# Altium schematic sheet Mako DSP Main R1.2.SchDoc
size B
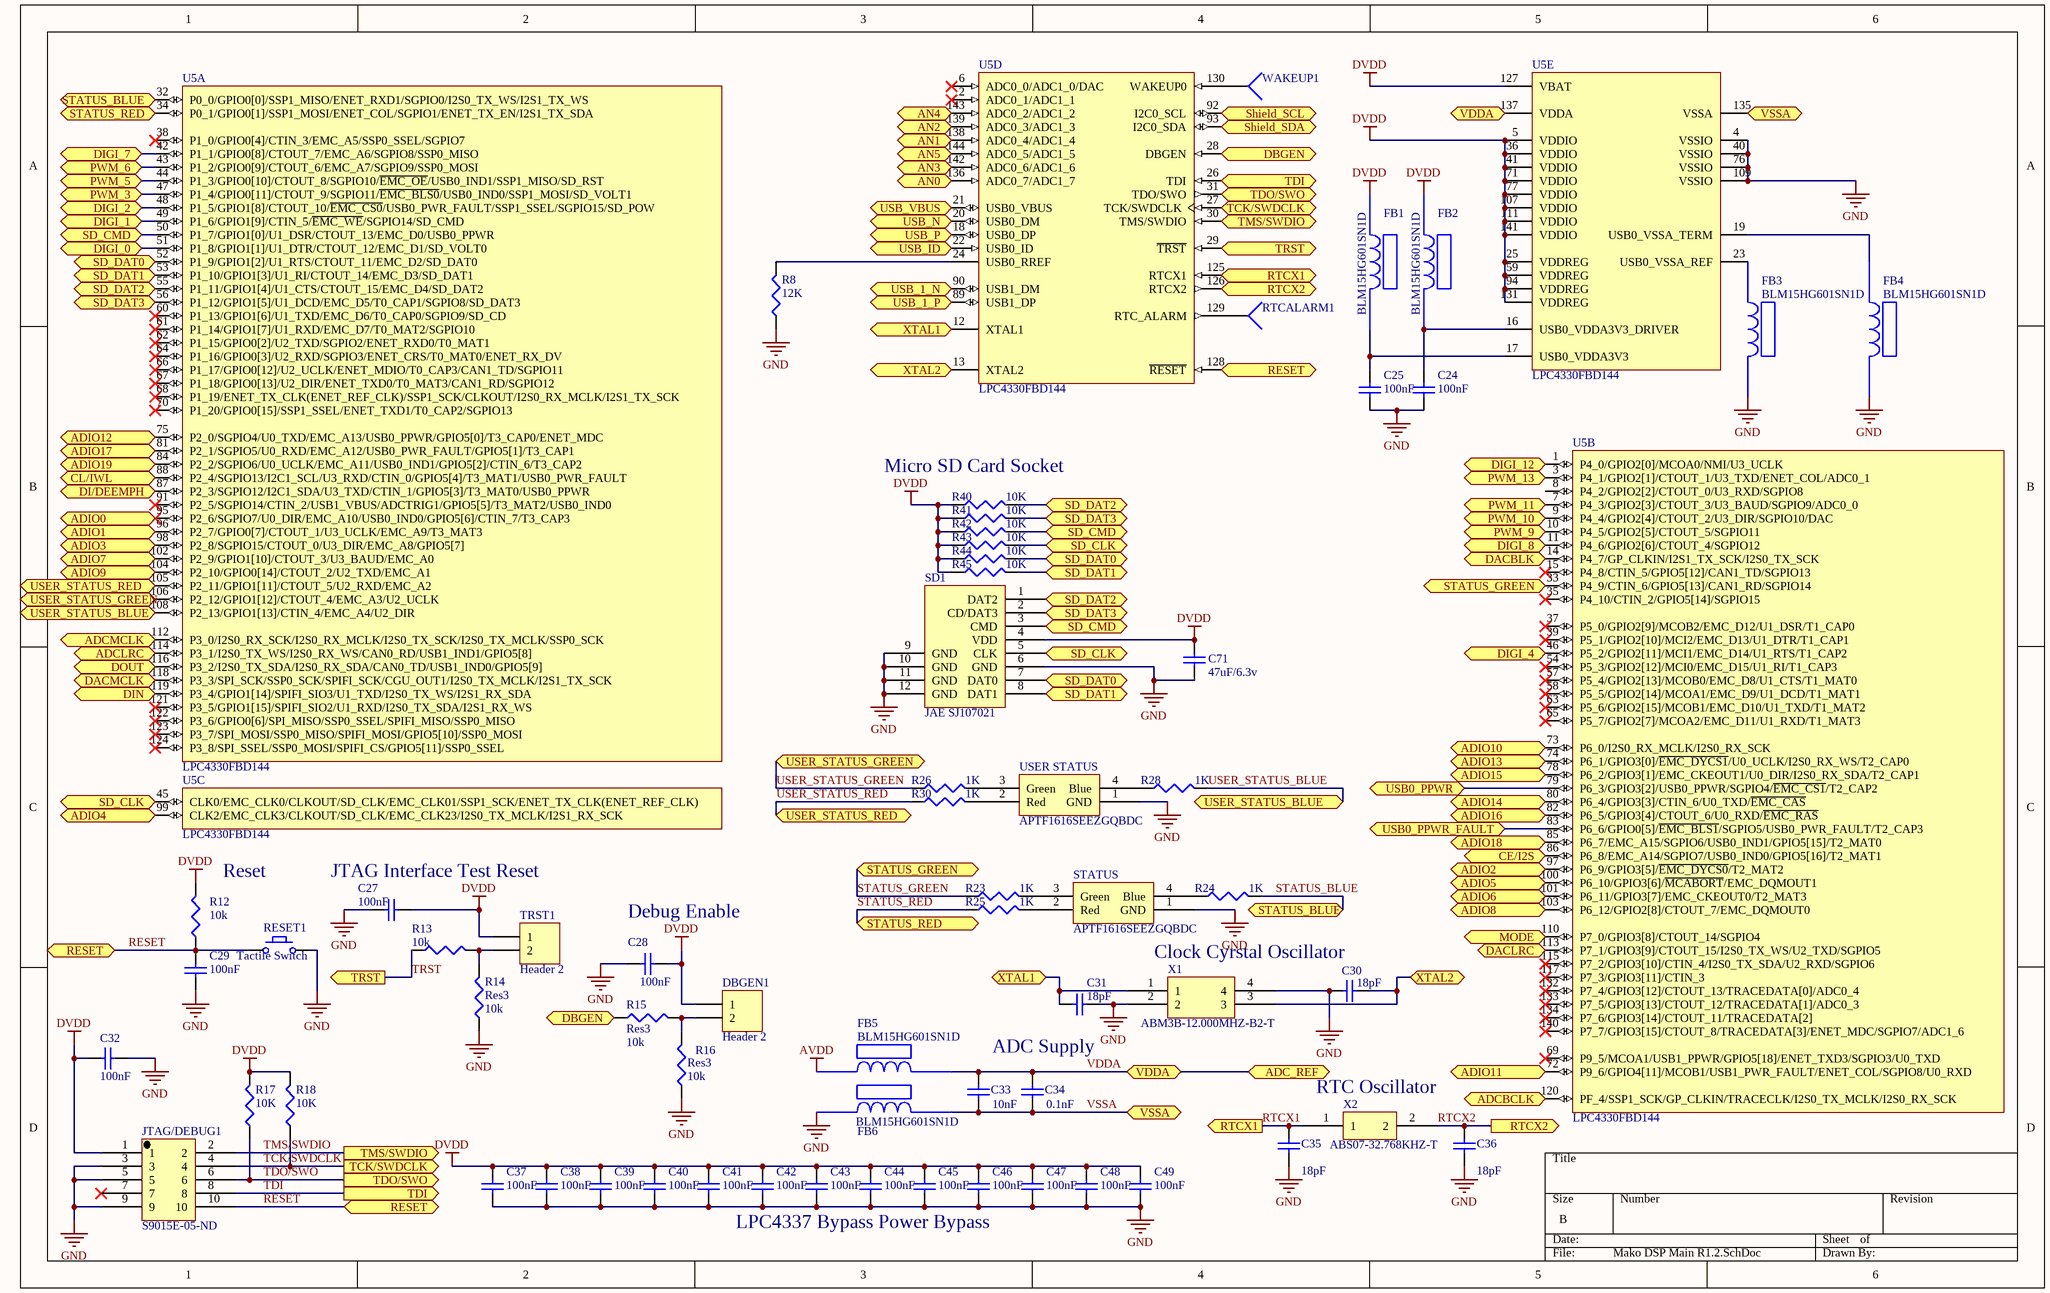
[diagram p0: Mako DSP Main R1.2.SchDoc]

## Parts
C24  value 100nF  [0402]  (hidden comment: Cap Semi)
C25  value 100nF  [0402]  (hidden comment: Cap Semi)
C27  C1: 100nF  [CAPC1608L]  (hidden comment: Cap Semi)
C28  C1: 100nF  [CAPC1608L]  (hidden comment: Cap Semi)
C29  C1: 100nF  [CAPC1608L]  (hidden comment: Cap Semi)
C30  value 18pF  [1608[0603]]  (hidden comment: Cap Semi)
C31  value 18pF  [1608[0603]]  (hidden comment: Cap Semi)
C32  C1: 100nF  [CAPC1608L]  (hidden comment: Cap Semi)
C33  value 10nF  [1608[0603]]  (hidden comment: Cap Semi)
C34  value 0.1nF  [1608[0603]]  (hidden comment: Cap Semi)
C35  value 18pF  [1608[0603]]  (hidden comment: Cap Semi)
C36  value 18pF  [1608[0603]]  (hidden comment: Cap Semi)
C37  value 100nF  [1608[0603]]  (hidden comment: Cap Semi)
C38  value 100nF  [1608[0603]]  (hidden comment: Cap Semi)
C39  value 100nF  [1608[0603]]  (hidden comment: Cap Semi)
C40  value 100nF  [1608[0603]]  (hidden comment: Cap Semi)
C41  value 100nF  [1608[0603]]  (hidden comment: Cap Semi)
C42  value 100nF  [1608[0603]]  (hidden comment: Cap Semi)
C43  value 100nF  [1608[0603]]  (hidden comment: Cap Semi)
C44  value 100nF  [1608[0603]]  (hidden comment: Cap Semi)
C45  value 100nF  [1608[0603]]  (hidden comment: Cap Semi)
C46  value 100nF  [1608[0603]]  (hidden comment: Cap Semi)
C47  value 100nF  [1608[0603]]  (hidden comment: Cap Semi)
C48  value 100nF  [1608[0603]]  (hidden comment: Cap Semi)
C49  value 100nF  [1608[0603]]  (hidden comment: Cap Semi)
C71  value 47uF/6.3v  [Panasonic VS B]  (hidden comment: Cap Semi)
DBGEN1  Header 2  [HDR1X2]
FB1  BLM15HG601SN1D  [BLM18PG121SN1D]
FB2  BLM15HG601SN1D  [BLM18PG121SN1D]
FB3  BLM15HG601SN1D  [BLM18PG121SN1D]
FB4  BLM15HG601SN1D  [BLM18PG121SN1D]
FB5  BLM15HG601SN1D  [BLM18PG121SN1D]
FB6  BLM15HG601SN1D  [BLM18PG121SN1D]
JTAG/DEBUG1  S9015E-05-ND  [S9015E-05-ND]
R8  value 12K  [J1-0603]  (hidden comment: Res3)
R12  value 10k  [J1-0603]  (hidden comment: Res3)
R13  value 10k  [J1-0603]  (hidden comment: Res3)
R14  Res3  value 10k  [J1-0603]
R15  Res3  value 10k  [J1-0603]
R16  Res3  value 10k  [J1-0603]
R17  value 10K  [J1-0603]  (hidden comment: Res3)
R18  value 10K  [J1-0603]  (hidden comment: Res3)
R23  value 1K  [J1-0603]  (hidden comment: Res3)
R24  value 1K  [J1-0603]  (hidden comment: Res3)
R25  value 1K  [J1-0603]  (hidden comment: Res3)
R26  value 1K  [J1-0603]  (hidden comment: Res3)
R28  value 1K  [J1-0603]  (hidden comment: Res3)
R30  value 1K  [J1-0603]  (hidden comment: Res3)
R40  value 10K  [J1-0603]  (hidden comment: Res3)
R41  value 10K  [J1-0603]  (hidden comment: Res3)
R42  value 10K  [J1-0603]  (hidden comment: Res3)
R43  value 10K  [J1-0603]  (hidden comment: Res3)
R44  value 10K  [J1-0603]  (hidden comment: Res3)
R45  value 10K  [J1-0603]  (hidden comment: Res3)
RESET1  Tactile Switch  [TL3301]
RTCALARM1  Socket  [PIN1]  (value not drawn)
SD1  JAE SJ107021  [JAE SJ107021]
STATUS  APTF1616SEEZGQBDC  [RGB LED APTF1616SEEZGQBDC]
TRST1  Header 2  [HDR1X2]
U5  LPC4330FBD144  [SOT486-1_V]  (parts A,B,C,D,E of 5)
USER_STATUS  APTF1616SEEZGQBDC  [RGB LED APTF1616SEEZGQBDC]
WAKEUP1  Socket  [PIN1]  (value not drawn)
X1  ABM3B-12.000MHZ-B2-T  [ABM3B-12.000MHZ-B2-T]
X2  ABS07-32.768KHZ-T  [ABS07-32.768KHZ-T]

## Ports
ADC_REF, ADCBCLK (bidir), ADCLRC (bidir), ADCMCLK (bidir), ADIO0 (bidir), ADIO1 (bidir), ADIO2 (bidir), ADIO3 (bidir), ADIO4, ADIO5 (bidir), ADIO6 (bidir), ADIO7, ADIO8 (bidir), ADIO9, ADIO10 (bidir), ADIO11 (bidir), ADIO12 (bidir), ADIO13 (bidir), ADIO14 (bidir), ADIO15 (bidir), ADIO16 (bidir), ADIO17 (bidir), ADIO18 (bidir), ADIO19 (bidir), AN0 (bidir), AN1 (bidir), AN2 (bidir), AN3 (bidir), AN4 (bidir), AN5 (bidir), CE/I2S (bidir), CL/IWL (bidir), DACBLK (bidir), DACLRC (bidir), DACMCLK (bidir), DBGEN (in), DBGEN (out), DI/DEEMPH (bidir), DIGI_0 (bidir), DIGI_1 (bidir), DIGI_2 (bidir), DIGI_4 (bidir), DIGI_7 (bidir), DIGI_8 (bidir), DIGI_12 (bidir), DIN (bidir), DOUT (bidir), MODE (bidir), PWM_3 (bidir), PWM_5 (bidir), PWM_6 (bidir), PWM_9 (bidir), PWM_10 (bidir), PWM_11 (bidir), PWM_13 (bidir), RESET (bidir), RTCX1 (in), RTCX1 (out), RTCX2 (out), SD_CLK (bidir), SD_CMD (bidir), SD_DAT0 (bidir), SD_DAT1 (bidir), SD_DAT2 (bidir), SD_DAT3 (bidir), Shield_SCL (bidir), Shield_SDA (bidir), STATUS_BLUE (bidir), STATUS_GREEN (bidir), STATUS_RED (bidir), TCK/SWDCLK (in), TCK/SWDCLK (out), TDI (in), TDI (out), TDO/SWO (out), TMS/SWDIO (in), TMS/SWDIO (out), TRST (in), TRST (out), USB0_PPWR (bidir), USB0_PPWR_FAULT (bidir), USB_1_N (bidir), USB_1_P (bidir), USB_ID (bidir), USB_N (bidir), USB_P (bidir), USB_VBUS (bidir), USER_STATUS_BLUE (bidir), USER_STATUS_GREEN (bidir), USER_STATUS_RED (bidir), VDDA, VSSA, XTAL1 (bidir), XTAL2 (bidir)

## Nets
AVDD: FB5.1
DVDD: C27.2 C28.2 C32.1 C37.2 C38.2 C39.2 C40.2 C41.2 C42.2 C43.2 C44.2 C45.2 C46.2 C47.2 C48.2 C49.2 C71.2 DBGEN1.1 FB1.1 FB2.1 JTAG/DEBUG1.1 R12.2 R17.2 R18.2 R40.1 R41.1 R42.1 R43.1 R44.1 R45.1 SD1.4(VDD) TRST1.1 U5.5(VDDIO) U5.25(VDDREG) U5.36(VDDIO) U5.41(VDDIO) U5.59(VDDREG) U5.71(VDDIO) U5.77(VDDIO) U5.94(VDDREG) U5.107(VDDIO) U5.111(VDDIO) U5.127(VBAT) U5.131(VDDREG) U5.141(VDDIO)
GND: C24.1 C25.1 C27.1 C28.1 C29.1 C30.2 C31.1 C32.2 C35.1 C36.1 C37.1 C38.1 C39.1 C40.1 C41.1 C42.1 C43.1 C44.1 C45.1 C46.1 C47.1 C48.1 C49.1 C71.1 FB3.2 FB4.2 FB6.1 JTAG/DEBUG1.3 JTAG/DEBUG1.5 JTAG/DEBUG1.9 R8.1 R14.1 R16.1 RESET1.2 SD1.6(GND) SD1.9(GND) SD1.10(GND) SD1.11(GND) SD1.12(GND) STATUS.1(GND) U5.4(VSSIO) U5.40(VSSIO) U5.76(VSSIO) U5.109(VSSIO) USER_STATUS.1(GND) X1.2 X1.4
ADCBCLK: U5.120(PF_4/SSP1_SCK/GP_CLKIN/TRACECLK/I2S0_TX_MCLK/I2S0_RX_SCK) ; port ADCBCLK
ADCLRC: U5.114(P3_1/I2S0_TX_WS/I2S0_RX_WS/CAN0_RD/USB1_IND1/GPIO5[8]) ; port ADCLRC
ADCMCLK: U5.112(P3_0/I2S0_RX_SCK/I2S0_RX_MCLK/I2S0_TX_SCK/I2S0_TX_MCLK/SSP0_SCK) ; port ADCMCLK
ADIO0: U5.95(P2_6/SGPIO7/U0_DIR/EMC_A10/USB0_IND0/GPIO5[6]/CTIN_7/T3_CAP3) ; port ADIO0
ADIO1: U5.96(P2_7/GPIO0[7]/CTOUT_1/U3_UCLK/EMC_A9/T3_MAT3) ; port ADIO1
ADIO2: U5.97(P6_9/GPIO3[5]/~{EMC_DYCS0}/T2_MAT2) ; port ADIO2
ADIO3: U5.98(P2_8/SGPIO15/CTOUT_0/U3_DIR/EMC_A8/GPIO5[7]) ; port ADIO3
ADIO4: U5.99(CLK2/EMC_CLK3/CLKOUT/SD_CLK/EMC_CLK23/I2S0_TX_MCLK/I2S1_RX_SCK) ; port ADIO4
ADIO5: U5.100(P6_10/GPIO3[6]/~{MCABORT}/EMC_DQMOUT1) ; port ADIO5
ADIO6: U5.101(P6_11/GPIO3[7]/EMC_CKEOUT0/T2_MAT3) ; port ADIO6
ADIO7: U5.102(P2_9/GPIO1[10]/CTOUT_3/U3_BAUD/EMC_A0) ; port ADIO7
ADIO8: U5.103(P6_12/GPIO2[8]/CTOUT_7/EMC_DQMOUT0) ; port ADIO8
ADIO9: U5.104(P2_10/GPIO0[14]/CTOUT_2/U2_TXD/EMC_A1) ; port ADIO9
ADIO10: U5.73(P6_0/I2S0_RX_MCLK/I2S0_RX_SCK) ; port ADIO10
ADIO11: U5.72(P9_6/GPIO4[11]/MCOB1/USB1_PWR_FAULT/ENET_COL/SGPIO8/U0_RXD) ; port ADIO11
ADIO12: U5.75(P2_0/SGPIO4/U0_TXD/EMC_A13/USB0_PPWR/GPIO5[0]/T3_CAP0/ENET_MDC) ; port ADIO12
ADIO13: U5.74(P6_1/GPIO3[0]/~{EMC_DYCS1}/U0_UCLK/I2S0_RX_WS/T2_CAP0) ; port ADIO13
ADIO14: U5.80(P6_4/GPIO3[3]/CTIN_6/U0_TXD/~{EMC_CAS}) ; port ADIO14
ADIO15: U5.78(P6_2/GPIO3[1]/EMC_CKEOUT1/U0_DIR/I2S0_RX_SDA/T2_CAP1) ; port ADIO15
ADIO16: U5.82(P6_5/GPIO3[4]/CTOUT_6/U0_RXD/~{EMC_RAS}) ; port ADIO16
ADIO17: U5.81(P2_1/SGPIO5/U0_RXD/EMC_A12/USB0_PWR_FAULT/GPIO5[1]/T3_CAP1) ; port ADIO17
ADIO18: U5.85(P6_7/EMC_A15/SGPIO6/USB0_IND1/GPIO5[15]/T2_MAT0) ; port ADIO18
ADIO19: U5.84(P2_2/SGPIO6/U0_UCLK/EMC_A11/USB0_IND1/GPIO5[2]/CTIN_6/T3_CAP2) ; port ADIO19
AN0: U5.136(ADC0_7/ADC1_7) ; port AN0
AN1: U5.138(ADC0_4/ADC1_4) ; port AN1
AN2: U5.139(ADC0_3/ADC1_3) ; port AN2
AN3: U5.142(ADC0_6/ADC1_6) ; port AN3
AN4: U5.143(ADC0_2/ADC1_2) ; port AN4
AN5: U5.144(ADC0_5/ADC1_5) ; port AN5
CE/I2S: U5.86(P6_8/EMC_A14/SGPIO7/USB0_IND0/GPIO5[16]/T2_MAT1) ; port CE/I2S
CL/IWL: U5.88(P2_4/SGPIO13/I2C1_SCL/U3_RXD/CTIN_0/GPIO5[4]/T3_MAT1/USB0_PWR_FAULT) ; port CL/IWL
DACBLK: U5.14(P4_7/GP_CLKIN/I2S1_TX_SCK/I2S0_TX_SCK) ; port DACBLK
DACLRC: U5.113(P7_1/GPIO3[9]/CTOUT_15/I2S0_TX_WS/U2_TXD/SGPIO5) ; port DACLRC
DACMCLK: U5.118(P3_3/SPI_SCK/SSP0_SCK/SPIFI_SCK/CGU_OUT1/I2S0_TX_MCLK/I2S1_TX_SCK) ; port DACMCLK
DBGEN: R15.1 U5.28(DBGEN) ; port DBGEN
DI/DEEMPH: U5.87(P2_3/SGPIO12/I2C1_SDA/U3_TXD/CTIN_1/GPIO5[3]/T3_MAT0/USB0_PPWR) ; port DI/DEEMPH
DIGI_0: U5.51(P1_8/GPIO1[1]/U1_DTR/CTOUT_12/EMC_D1/SD_VOLT0) ; port DIGI_0
DIGI_1: U5.49(P1_6/GPIO1[9]/CTIN_5/~{EMC_WE}/SGPIO14/SD_CMD) ; port DIGI_1
DIGI_2: U5.48(P1_5/GPIO1[8]/CTOUT_10/~{EMC_CS0}/USB0_PWR_FAULT/SSP1_SSEL/SGPIO15/SD_POW) ; port DIGI_2
DIGI_4: U5.46(P5_2/GPIO2[11]/MCI1/EMC_D14/U1_RTS/T1_CAP2) ; port DIGI_4
DIGI_7: U5.42(P1_1/GPIO0[8]/CTOUT_7/EMC_A6/SGPIO8/SSP0_MISO) ; port DIGI_7
DIGI_8: U5.11(P4_6/GPIO2[6]/CTOUT_4/SGPIO12) ; port DIGI_8
DIGI_12: U5.1(P4_0/GPIO2[0]/MCOA0/NMI/U3_UCLK) ; port DIGI_12
DIN: U5.119(P3_4/GPIO1[14]/SPIFI_SIO3/U1_TXD/I2S0_TX_WS/I2S1_RX_SDA) ; port DIN
DOUT: U5.116(P3_2/I2S0_TX_SDA/I2S0_RX_SDA/CAN0_TD/USB1_IND0/GPIO5[9]) ; port DOUT
MODE: U5.110(P7_0/GPIO3[8]/CTOUT_14/SGPIO4) ; port MODE
PWM_3: U5.47(P1_4/GPIO0[11]/CTOUT_9/SGPIO11/~{EMC_BLS0}/USB0_IND0/SSP1_MOSI/SD_VOLT1) ; port PWM_3
PWM_5: U5.44(P1_3/GPIO0[10]/CTOUT_8/SGPIO10/~{EMC_OE}/USB0_IND1/SSP1_MISO/SD_RST) ; port PWM_5
PWM_6: U5.43(P1_2/GPIO0[9]/CTOUT_6/EMC_A7/SGPIO9/SSP0_MOSI) ; port PWM_6
PWM_9: U5.10(P4_5/GPIO2[5]/CTOUT_5/SGPIO11) ; port PWM_9
PWM_10: U5.9(P4_4/GPIO2[4]/CTOUT_2/U3_DIR/SGPIO10/DAC) ; port PWM_10
PWM_11: U5.7(P4_3/GPIO2[3]/CTOUT_3/U3_BAUD/SGPIO9/ADC0_0) ; port PWM_11
PWM_13: U5.3(P4_1/GPIO2[1]/CTOUT_1/U3_TXD/ENET_COL/ADC0_1) ; port PWM_13
RESET: C29.2 JTAG/DEBUG1.10 R12.1 RESET1.1 U5.128(~{RESET}) ; port RESET
RTCX1: C35.2 U5.125(RTCX1) X2.1 ; port RTCX1
RTCX2: C36.2 U5.126(RTCX2) X2.2 ; port RTCX2
SD_CLK: R43.2 SD1.5(CLK) U5.45(CLK0/EMC_CLK0/CLKOUT/SD_CLK/EMC_CLK01/SSP1_SCK/ENET_TX_CLK(ENET_REF_CLK)) ; port SD_CLK
SD_CMD: R42.2 SD1.3(CMD) U5.50(P1_7/GPIO1[0]/U1_DSR/CTOUT_13/EMC_D0/USB0_PPWR) ; port SD_CMD
SD_DAT0: R44.2 SD1.7(DAT0) U5.52(P1_9/GPIO1[2]/U1_RTS/CTOUT_11/EMC_D2/SD_DAT0) ; port SD_DAT0
SD_DAT1: R45.2 SD1.8(DAT1) U5.53(P1_10/GPIO1[3]/U1_RI/CTOUT_14/EMC_D3/SD_DAT1) ; port SD_DAT1
SD_DAT2: R40.2 SD1.1(DAT2) U5.55(P1_11/GPIO1[4]/U1_CTS/CTOUT_15/EMC_D4/SD_DAT2) ; port SD_DAT2
SD_DAT3: R41.2 SD1.2(CD/DAT3) U5.56(P1_12/GPIO1[5]/U1_DCD/EMC_D5/T0_CAP1/SGPIO8/SD_DAT3) ; port SD_DAT3
Shield_SCL: U5.92(I2C0_SCL) ; port Shield_SCL
Shield_SDA: U5.93(I2C0_SDA) ; port Shield_SDA
STATUS_BLUE: R24.2 U5.32(P0_0/GPIO0[0]/SSP1_MISO/ENET_RXD1/SGPIO0/I2S0_TX_WS/I2S1_TX_WS) ; port STATUS_BLUE
STATUS_GREEN: R23.1 U5.33(P4_9/CTIN_6/GPIO5[13]/CAN1_RD/SGPIO14) ; port STATUS_GREEN
STATUS_RED: R25.1 U5.34(P0_1/GPIO0[1]/SSP1_MOSI/ENET_COL/SGPIO1/ENET_TX_EN/I2S1_TX_SDA) ; port STATUS_RED
TCK/SWDCLK: JTAG/DEBUG1.4 R18.1 U5.27(TCK/SWDCLK) ; port TCK/SWDCLK
TDI: JTAG/DEBUG1.8 U5.26(TDI) ; port TDI
TDO/SWO: JTAG/DEBUG1.6 R17.1 U5.31(TDO/SWO) ; port TDO/SWO
TMS/SWDIO: JTAG/DEBUG1.2 U5.30(TMS/SWDIO) ; port TMS/SWDIO
TRST: R13.1 U5.29(~{TRST}) ; port TRST
USB0_PPWR: U5.79(P6_3/GPIO3[2]/USB0_PPWR/SGPIO4/~{EMC_CS1}/T2_CAP2) ; port USB0_PPWR
USB0_PPWR_FAULT: U5.83(P6_6/GPIO0[5]/~{EMC_BLS1}/SGPIO5/USB0_PWR_FAULT/T2_CAP3) ; port USB0_PPWR_FAULT
USB_1_N: U5.90(USB1_DM) ; port USB_1_N
USB_1_P: U5.89(USB1_DP) ; port USB_1_P
USB_ID: U5.22(USB0_ID) ; port USB_ID
USB_N: U5.20(USB0_DM) ; port USB_N
USB_P: U5.18(USB0_DP) ; port USB_P
USB_VBUS: U5.21(USB0_VBUS) ; port USB_VBUS
USER_STATUS_BLUE: R28.2 U5.108(P2_13/GPIO1[13]/CTIN_4/EMC_A4/U2_DIR) ; port USER_STATUS_BLUE
USER_STATUS_GREEN: R26.1 U5.106(P2_12/GPIO1[12]/CTOUT_4/EMC_A3/U2_UCLK) ; port USER_STATUS_GREEN
USER_STATUS_RED: R30.1 U5.105(P2_11/GPIO1[11]/CTOUT_5/U2_RXD/EMC_A2) ; port USER_STATUS_RED
VDDA: C33.2 C34.2 FB5.2 U5.137(VDDA) ; port VDDA, port ADC_REF
VSSA: C33.1 C34.1 FB6.2 U5.135(VSSA) ; port VSSA
XTAL1: C31.2 U5.12(XTAL1) X1.1 ; port XTAL1
XTAL2: C30.1 U5.13(XTAL2) X1.3 ; port XTAL2
NetC24_2: C24.2 FB2.2 U5.16(USB0_VDDA3V3_DRIVER)
NetC25_2: C25.2 FB1.2 U5.17(USB0_VDDA3V3)
NetDBGEN1_2: DBGEN1.2 R15.2 R16.2
NetFB3_1: FB3.1 U5.23(USB0_VSSA_REF)
NetFB4_1: FB4.1 U5.19(USB0_VSSA_TERM)
NetR8_2: R8.2 U5.24(USB0_RREF)
NetR13_2: R13.2 R14.2 TRST1.2
NetR23_2: R23.2 STATUS.3(Green)
NetR24_1: R24.1 STATUS.4(Blue)
NetR25_2: R25.2 STATUS.2(Red)
NetR26_2: R26.2 USER_STATUS.3(Green)
NetR28_1: R28.1 USER_STATUS.4(Blue)
NetR30_2: R30.2 USER_STATUS.2(Red)
NetRTCALARM1_1: RTCALARM1.1 U5.129(RTC_ALARM)
NetU5_130: U5.130(WAKEUP0) WAKEUP1.1

Not connected (* = marked no-connect by the designer): JTAG/DEBUG1 7*; U5 2(ADC0_1/ADC1_1)* 6(ADC0_0/ADC1_0/DAC)* 8(P4_2/GPIO2[2]/CTOUT_0/U3_RXD/SGPIO8) 15(P4_8/CTIN_5/GPIO5[12]/CAN1_TD/SGPIO13)* 35(P4_10/CTIN_2/GPIO5[14]/SGPIO15)* 37(P5_0/GPIO2[9]/MCOB2/EMC_D12/U1_DSR/T1_CAP0)* 38(P1_0/GPIO0[4]/CTIN_3/EMC_A5/SSP0_SSEL/SGPIO7)* 39(P5_1/GPIO2[10]/MCI2/EMC_D13/U1_DTR/T1_CAP1)* 54(P5_3/GPIO2[12]/MCI0/EMC_D15/U1_RI/T1_CAP3)* 57(P5_4/GPIO2[13]/MCOB0/EMC_D8/U1_CTS/T1_MAT0)* 58(P5_5/GPIO2[14]/MCOA1/EMC_D9/U1_DCD/T1_MAT1)* 60(P1_13/GPIO1[6]/U1_TXD/EMC_D6/T0_CAP0/SGPIO9/SD_CD)* 61(P1_14/GPIO1[7]/U1_RXD/EMC_D7/T0_MAT2/SGPIO10)* 62(P1_15/GPIO0[2]/U2_TXD/SGPIO2/ENET_RXD0/T0_MAT1)* 63(P5_6/GPIO2[15]/MCOB1/EMC_D10/U1_TXD/T1_MAT2)* 64(P1_16/GPIO0[3]/U2_RXD/SGPIO3/ENET_CRS/T0_MAT0/ENET_RX_DV)* 65(P5_7/GPIO2[7]/MCOA2/EMC_D11/U1_RXD/T1_MAT3)* 66(P1_17/GPIO0[12]/U2_UCLK/ENET_MDIO/T0_CAP3/CAN1_TD/SGPIO11)* 67(P1_18/GPIO0[13]/U2_DIR/ENET_TXD0/T0_MAT3/CAN1_RD/SGPIO12)* 68(P1_19/ENET_TX_CLK(ENET_REF_CLK)/SSP1_SCK/CLKOUT/I2S0_RX_MCLK/I2S1_TX_SCK)* 69(P9_5/MCOA1/USB1_PPWR/GPIO5[18]/ENET_TXD3/SGPIO3/U0_TXD)* 70(P1_20/GPIO0[15]/SSP1_SSEL/ENET_TXD1/T0_CAP2/SGPIO13)* 91(P2_5/SGPIO14/CTIN_2/USB1_VBUS/ADCTRIG1/GPIO5[5]/T3_MAT2/USB0_IND0)* 115(P7_2/GPIO3[10]/CTIN_4/I2S0_TX_SDA/U2_RXD/SGPIO6)* 117(P7_3/GPIO3[11]/CTIN_3)* 121(P3_5/GPIO1[15]/SPIFI_SIO2/U1_RXD/I2S0_TX_SDA/I2S1_RX_WS)* 122(P3_6/GPIO0[6]/SPI_MISO/SSP0_SSEL/SPIFI_MISO/SSP0_MISO)* 123(P3_7/SPI_MOSI/SSP0_MISO/SPIFI_MOSI/GPIO5[10]/SSP0_MOSI)* 124(P3_8/SPI_SSEL/SSP0_MOSI/SPIFI_CS/GPIO5[11]/SSP0_SSEL)* 132(P7_4/GPIO3[12]/CTOUT_13/TRACEDATA[0]/ADC0_4)* 133(P7_5/GPIO3[13]/CTOUT_12/TRACEDATA[1]/ADC0_3)* 134(P7_6/GPIO3[14]/CTOUT_11/TRACEDATA[2])* 140(P7_7/GPIO3[15]/CTOUT_8/TRACEDATA[3]/ENET_MDC/SGPIO7/ADC1_6)*

## Notes on the sheet
- Micro SD Card Socket
- (near R12) Reset
- (near C27) JTAG Interface Test Reset
- (near C28) Debug Enable
- Clock Cyrstal Oscillator
- ADC Supply
- RTC Oscillator
- LPC4337 Bypass Power Bypass

## Library data of the parts
C24 C25 C27-C49 C71 = Cap Semi: Capacitor (Semiconductor SIM Model); Published: 8-Jun-2000; LatestRevisionDate: 29-May-2009; LatestRevisionNote: IPC-7351 Footprint Added.; PackageReference: C1206; Publisher: Altium Limited; PackageDescription: Chip Capacitor
DBGEN1 TRST1 = Header 2: Header, 2-Pin; LatestRevisionDate: 17-Jul-2002; LatestRevisionNote: Re-released for DXP Platform.; Publisher: Altium Limited
R8 R12-R18 R23-R26 R28 R30 R40-R45 = Res3: Resistor; Published: 8-Jun-2000; LatestRevisionDate: 29-May-2009; LatestRevisionNote: IPC-7351 Footprint Added.; PackageReference: J1-0603; Publisher: Altium Limited; PackageDescription: Chip Resistor
SD1 = JAE SJ107021 microSD Card Socket
STATUS USER_STATUS = RGB LED APTF1616SEEZGQBDC: RGB LED
U5 = LPC4330FBD144: 32-bit ARM Cortex-M4 MCU, 264 kB SRAM, 2 HS USB with on-chip PHY, Ethernet, CAN, AES, SPIFI, SGPIO, SCT, 144-Pin LQFP; fmax: 204 MHz; GPIOs: 83; SRAM: 264 kB; ROM: 64 kB; Ethernet: Y; USB: 2; ADC channels: 8; SPI: 1; UART: 4; VDD (min): 2.2 V; VDD (max): 3.6 V; Code_IEC: 136E23; DatasheetVersion: Rev.3.1, Jan-2012; PackageVersion: Feb-2003; PackageReference: SOT486-1; PackageDescription: LQFP144: Plastic Low Profile Quad Flat Package; 144 Leads; Body 20 x 20 x 1.4 mm; PWM: Y; PLL: Y; I2C: 2; CAN: 2; Timers: 4; Code_JEDEC: MS-026; ComponentLink1Description: Manufacturer URL; ComponentLink1URL: http://www.nxp.com/; ComponentLink2Description: Datasheet; ComponentLink2URL: http://www.nxp.com/documents/data_sheet/LPC4350_30_20_10.pdf
X2 = ABS07-32.768KHZ-T: ABS07-32.768KHZ-T RTC Crystal Oscillator
RTCALARM1 WAKEUP1 = Socket: LatestRevisionDate: 17-Jul-2002; LatestRevisionNote: Re-released for DXP Platform.; Publisher: Altium Limited